# Altium project TK530_Kraftbakplan.PrjPcb
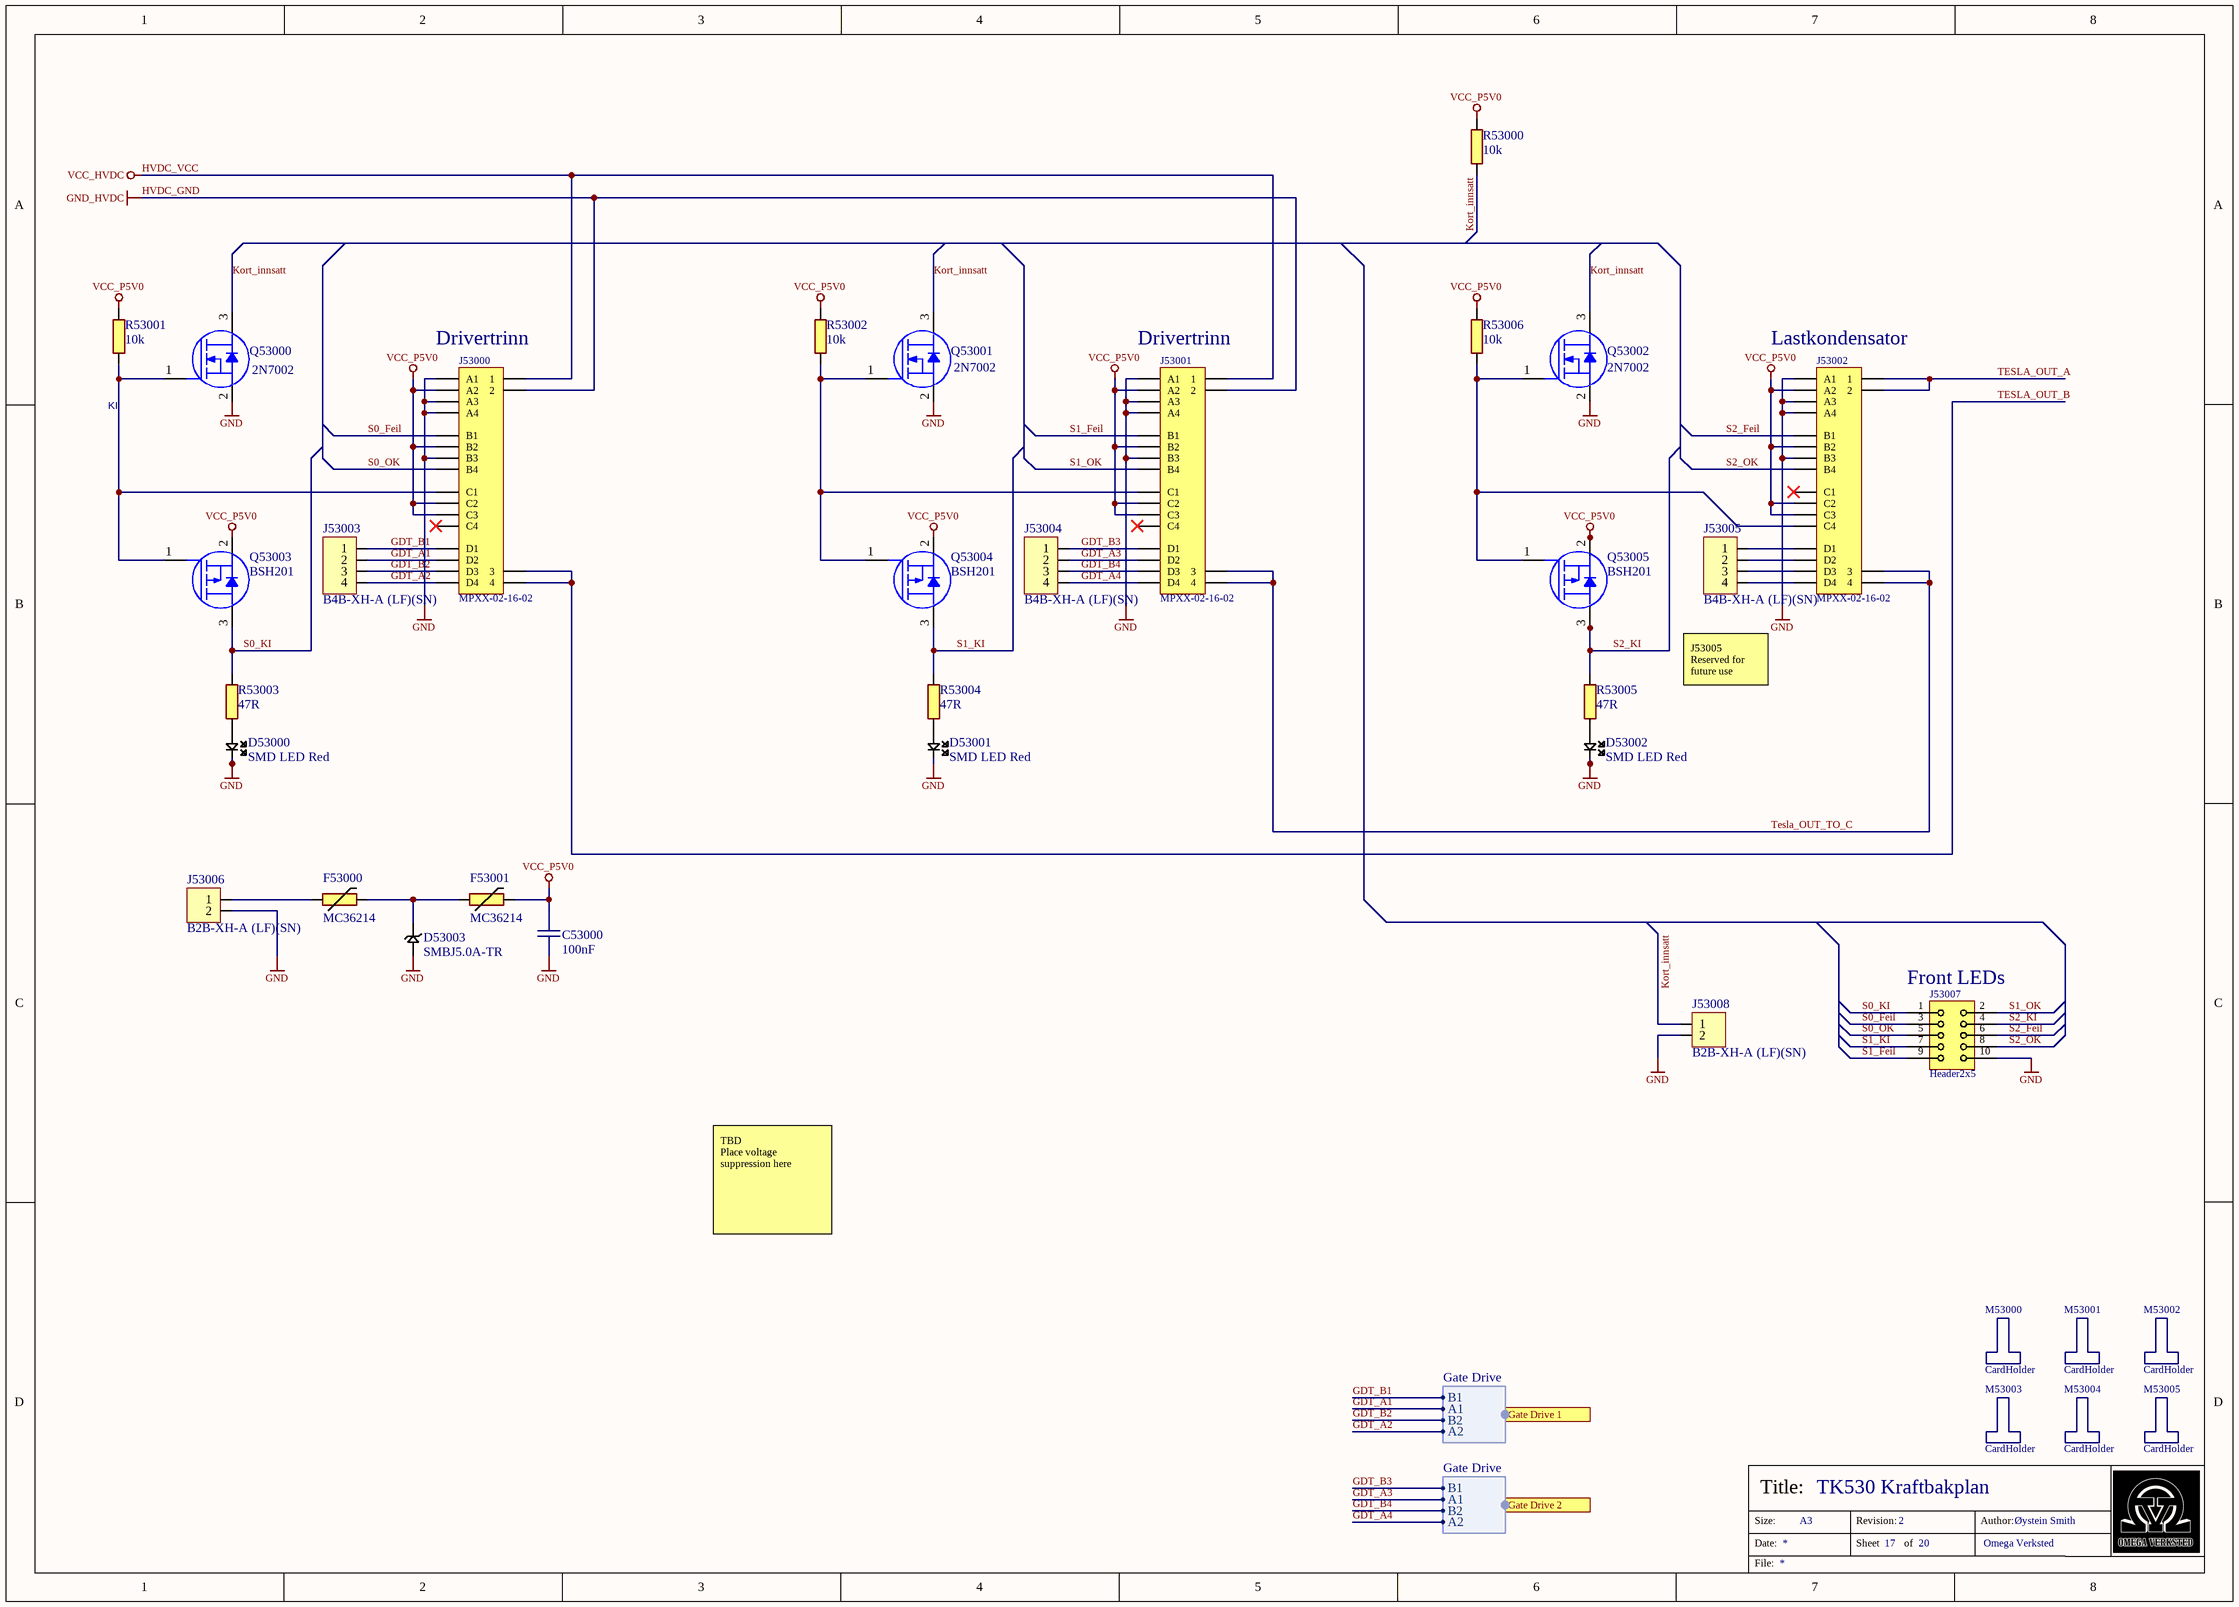
[diagram p0: TK530_Kraftbakplan.SchDoc]
1 sheet, 35 parts. Net scope: flat (ports and power ports of the same name join across sheets).
Board file: TK530_Kraftbakplan.PcbDoc

## Sheet TK530_Kraftbakplan.SchDoc: TK530 Kraftbakplan
size A3; Author: Øystein Smith; Organization: Omega Verksted; DocumentNumber: 17; Revision: 2; SheetNumber: 17; SheetTotal: 20

### Parts
C53000  100nF  [CAPC0603(1608)55_N]
D53000  SMD LED Red  [I_LEDC0603(1608)_N]
D53001  SMD LED Red  [I_LEDC0603(1608)_N]
D53002  SMD LED Red  [I_LEDC0603(1608)_N]
D53003  SMBJ5.0A-TR  [SODFL535X245-2N]
F53000  MC36214  [RESC0805(2012)_N]
F53001  MC36214  [RESC0805(2012)_N]
J53000  MPXX-02-16-02  [MPSC-02-16-02-7.70-03-L-V-LC]
J53001  MPXX-02-16-02  [MPSC-02-16-02-7.70-03-L-V-LC]
J53002  MPXX-02-16-02  [MPSC-02-16-02-7.70-03-L-V-LC]
J53003  B4B-XH-A (LF)(SN)  [JST_4P]
J53004  B4B-XH-A (LF)(SN)  [JST_4P]
J53005  B4B-XH-A (LF)(SN)  [JST_4P]
J53006  B2B-XH-A (LF)(SN)  [JST_2P]
J53007  Header2x5  [HDRV10W64P254_2X5_2030X900X900B]
J53008  B2B-XH-A (LF)(SN)  [JST_2P]
M53000  CardHolder  [CardHolder900X1900X5000]
M53001  CardHolder  [CardHolder900X1900X5000]
M53002  CardHolder  [CardHolder900X1900X5000]
M53003  CardHolder  [CardHolder900X1900X5000]
M53004  CardHolder  [CardHolder900X1900X5000]
M53005  CardHolder  [CardHolder900X1900X5000]
Q53000  2N7002  [SOT323_N]
Q53001  2N7002  [SOT323_N]
Q53002  2N7002  [SOT323_N]
Q53003  BSH201  [SOT23-3_N]
Q53004  BSH201  [SOT23-3_N]
Q53005  BSH201  [SOT23-3_N]
R53000  10k  [RESC0603(1608)_N]
R53001  10k  [RESC0603(1608)_N]
R53002  10k  [RESC0603(1608)_N]
R53003  47R  [RESC0603(1608)_N]
R53004  47R  [RESC0603(1608)_N]
R53005  47R  [RESC0603(1608)_N]
R53006  10k  [RESC0603(1608)_N]

### Ports
Gate Drive 1 (harness Gate Drive), Gate Drive 2 (harness Gate Drive)

### Harnesses
Gate Drive: B1, A1, B2, A2

### Nets
GND: C53000.1 D53000.2 D53001.2 D53002.2 D53003.1(A) J53000.5(A1) J53000.7(A3) J53000.8(A4) J53000.11(B3) J53001.5(A1) J53001.7(A3) J53001.8(A4) J53001.11(B3) J53002.5(A1) J53002.7(A3) J53002.8(A4) J53002.11(B3) J53006.2 J53007.10 J53008.2 Q53000.2(Source) Q53001.2(Source) Q53002.2(Source)
HVDC_GND: J53000.2 J53001.2  [also labelled GND_HVDC]
HVDC_VCC: J53000.1 J53001.1  [also labelled VCC_HVDC]
VCC_P5V0: C53000.2 F53001.2 J53000.6(A2) J53000.10(B2) J53000.14(C2) J53000.15(C3) J53001.6(A2) J53001.10(B2) J53001.14(C2) J53001.15(C3) J53002.6(A2) J53002.10(B2) J53002.14(C2) J53002.15(C3) Q53003.2(Source) Q53004.2(Source) Q53005.2(Source) R53000.2 R53001.2 R53002.2 R53006.2
GDT_A1: J53000.18(D2) J53003.2 ; port Gate Drive 1.A1
GDT_A2: J53000.20(D4) J53003.4 ; port Gate Drive 1.A2
GDT_A3: J53001.18(D2) J53004.2 ; port Gate Drive 2.A1
GDT_A4: J53001.20(D4) J53004.4 ; port Gate Drive 2.A2
GDT_B1: J53000.17(D1) J53003.1 ; port Gate Drive 1.B1
GDT_B2: J53000.19(D3) J53003.3 ; port Gate Drive 1.B2
GDT_B3: J53001.17(D1) J53004.1 ; port Gate Drive 2.B1
GDT_B4: J53001.19(D3) J53004.3 ; port Gate Drive 2.B2
Kort_innsatt: J53008.1 Q53000.3(Drain) Q53001.3(Drain) Q53002.3(Drain) R53000.1
S0_Feil: J53000.9(B1) J53007.3
S0_KI: J53007.1 Q53003.3(Drain) R53003.2
S0_OK: J53000.12(B4) J53007.5
S1_Feil: J53001.9(B1) J53007.9
S1_KI: J53007.7 Q53004.3(Drain) R53004.2
S1_OK: J53001.12(B4) J53007.2
S2_Feil: J53002.9(B1) J53007.6
S2_KI: J53007.4 Q53005.3(Drain) R53005.2
S2_OK: J53002.12(B4) J53007.8
TESLA_OUT_A: J53002.1 J53002.2
TESLA_OUT_B: J53000.3 J53000.4
Tesla_OUT_TO_C: J53001.3 J53001.4 J53002.3 J53002.4
NetD53000_1: D53000.1 R53003.1
NetD53001_1: D53001.1 R53004.1
NetD53002_1: D53002.1 R53005.1
NetD53003_2: D53003.2(K) F53000.2 F53001.1
NetF53000_1: F53000.1 J53006.1
NetJ53000_13: J53000.13(C1) Q53000.1(Gate) Q53003.1(Gate) R53001.1
NetJ53001_13: J53001.13(C1) Q53001.1(Gate) Q53004.1(Gate) R53002.1
NetJ53002_16: J53002.16(C4) Q53002.1(Gate) Q53005.1(Gate) R53006.1
NetJ53002_17: J53002.17(D1) J53005.1
NetJ53002_18: J53002.18(D2) J53005.2
NetJ53002_19: J53002.19(D3) J53005.3
NetJ53002_20: J53002.20(D4) J53005.4

Not connected (* = marked no-connect by the designer): J53000 16(C4)*; J53001 16(C4)*; J53002 13(C1)*

### Notes on the sheet
- KI
- (near J53000) Drivertrinn
- (near J53001) Drivertrinn
- (near J53002) Lastkondensator
- J53005 Reserved for future use
- (near J53007) Front LEDs
- TBD
  Place voltage suppression here
- Size:
- Date:
- Title:
- A3
- Revision:
- Sheet
- of
- Author:
- File:

### Library data of the parts
C53000 = 5152: X7R 50V 5%; pakke_opprettet_av: 815; pris: 1; nokkelord: Kondensator, Capacitor, CAP; pakketype: 0603; id: 5152; leverandor_varenr: 1759122; produsent: Multicomp; leverandor: Farnell; rad: 21; rom: OV; lager_type: Baklager; dybde: 0; antall: 1000; komponenttype: 2; navn: 100nF; pakke_opprettet: 18/02/2015 14:18:13; symbol_opprettet_av: 815; symbol_opprettet: 14/11/2014 20:19:34; hylle: 0
D53000-D53002 = 5143: SMD; pakke_opprettet_av: 815; pris: 1; pakketype: 0603; id: 5143; rad: 0; rom: OV; lager_type: Fremlager; dybde: 2; hylle: 6; antall: 50; leverandor_varenr: 8554641; produsent: Avago; leverandor: Farnell; komponenttype: 9; navn: SMD LED Red; pakke_opprettet: 06/07/2014 18:55:44; symbol_opprettet_av: 815; symbol_opprettet: 06/07/2014 18:59:47; nokkelord: SMD
D53003 = 5314: Transient Voltage Suppressor, TVS, Transil SMBJ Series, Unidirectional, 5 V, SMD, 2, 6.4 V; id: 5314; pakke_opprettet_av: 815; leverandor_varenr: 9886311; pris: 1; produsent: ST Microelectronics; leverandor: Farnell; komponenttype: 9; pakke_opprettet: 14/03/2016 19:17:15; symbol_opprettet_av: 815; symbol_opprettet: 28/06/2014 15:19:53; navn: SMBJ5.0A-TR; pakketype: SMD
F53000 F53001 = 5311: FUSE, PTC RESET, SMD, 16V, 500MA; id: 5311; pakke_opprettet_av: 815; leverandor_varenr: 1861181; pris: 2; produsent: Multicomp; leverandor: Farnell; pakketype: 0805; pakke_opprettet: 27/01/2016 14:23:16; symbol_opprettet_av: 815; symbol_opprettet: 11/03/2016 15:38:25; navn: MC36214
J53000-J53002 = 3220: SAMTEC Connector; pakke_opprettet_av: 815; pris: 30; pakketype: TH; id: 3220; komponenttype: 11; leverandor: Mouser; nokkelord: Kan kjøpes rett fra SAMTEC; navn: MPSC-02-16-02-7.70-03-L-V-LC; pakke_opprettet: 13/07/2014 16:35:38; symbol_opprettet_av: 815; symbol_opprettet: 13/07/2014 16:35:21; produsent: SAMTEC; leverandor_varenr: MPSC-02-16-02-7.70-03-L-V-LC
J53003-J53005 = 3046: JST 4pin (pris pr. stk.); pakke_opprettet_av: 815; pris: 2; nokkelord: Connector, Kontakt; pakketype: TH; id: 3046; rad: 3; rom: OV; lager_type: Fremlager; dybde: 0; hylle: 6; antall: 94; leverandor_varenr: 1516278; leverandor: Farnell; komponenttype: 11; navn: B4B-XH-A (LF)(SN); pakke_opprettet: 28/06/2014 18:25:23; symbol_opprettet_av: 815; symbol_opprettet: 28/06/2014 15:33:28; produsent: JST
J53006 = 4043: JST 2pin (pris pr. stk.); pakke_opprettet_av: 815; pris: 2; nokkelord: Connector, Kontakt; pakketype: TH; id: 4043; rad: 3; rom: OV; lager_type: Fremlager; dybde: 0; hylle: 6; antall: 120; leverandor_varenr: 1516276; leverandor: Farnell; komponenttype: 11; navn: B2B-XH-A (LF)(SN); pakke_opprettet: 28/06/2014 18:25:03; symbol_opprettet_av: 815; symbol_opprettet: 28/06/2014 15:33:17; produsent: JST
J53007 = 3224: Header; navn: Header 2X5 Shrouded; pakke_opprettet_av: 815; pris: 5; pakketype: TH; id: 3224; leverandor_varenr: 2215304; produsent: Amphenol; leverandor: Farnell; komponenttype: 11; pakke_opprettet: 12/07/2014 17:42:52; symbol_opprettet_av: 815; symbol_opprettet: 13/11/2014 11:03:55; nokkelord: Header
J53008 = 4043: JST 2pin (pris pr. stk.); id: 4043; pakke_opprettet_av: 815; pris: 2; nokkelord: Connector, Kontakt; pakketype: TH; rad: 3; rom: OV; lager_type: Fremlager; dybde: 0; hylle: 6; antall: 120; leverandor_varenr: 1516276; leverandor: Farnell; komponenttype: 11; pakke_opprettet: 28/06/2014 18:25:03; symbol_opprettet_av: 815; symbol_opprettet: 28/06/2014 15:33:17; navn: B2B-XH-A (LF)(SN); produsent: JST
M53000-M53005 = 4028: Støtter kort i bakplan; navn: KortStøtte 50mm; pakke_opprettet_av: 815; pris: 5; nokkelord: support, cardholder, kortholder; pakketype: TH; id: 4028; pakke_opprettet: 25/03/2017 04:47:31; symbol_opprettet_av: 815; symbol_opprettet: 12/07/2014 20:29:53
Q53000-Q53002 = 3075: N-Channel MOSFET 300mA; id: 3075; rad: 2; rom: OV; lager_type: Fremlager; dybde: 0; hylle: 3; antall: 810; pakke_opprettet_av: 1165; symbol_opprettet_av: 774; leverandor_varenr: 1829184; pris: 1; leverandor: Farnell; pakketype: SOT-323; komponenttype: 4; pakke_opprettet: 12/05/2018 20:42:12; symbol_opprettet: 11/07/2014 23:17:04; navn: 2N7002
Q53003-Q53005 = 3085: P-Channel MOSFET 300mA; id: 3085; pakke_opprettet_av: 815; symbol_opprettet_av: 1150; leverandor_varenr: 1758073; pris: 3; produsent: NXP Semiconductors; leverandor: Farnell; pakketype: SOT; rom: OV; lager_type: Fremlager; dybde: 0; antall: 51; komponenttype: 4; Status: New; pakke_opprettet: 08/07/2014 20:37:25; symbol_opprettet: 14/09/2016 17:47:57; navn: BSH201; rad: 3; hylle: 3
R53000-R53002 R53006 = 5264: 0.1W 1% Thick film resistor; id: 5264; rad: 0; rom: OV; lager_type: Fremlager; dybde: 72; hylle: 2; antall: 4; pakke_opprettet_av: 815; leverandor_varenr: 2447230; nokkelord: Resistor Motstand; produsent: Multicomp; leverandor: Farnell; pakketype: 0603; komponenttype: 1; pakke_opprettet: 08/07/2014 21:15:30; symbol_opprettet_av: 815; symbol_opprettet: 08/07/2014 21:16:33; navn: 10k; pris: 0
R53003-R53005 = 4889: 0.1W 1% Thick film resistor; rad: 0; rom: OV; lager_type: Fremlager; dybde: 16; hylle: 2; antall: 195; pakke_opprettet_av: 815; pakketype: 0603; id: 4889; komponenttype: 1; leverandor: Farnell; leverandor_varenr: 2447378; produsent: Multicomp; navn: 47R; pakke_opprettet: 08/07/2014 21:15:30; symbol_opprettet_av: 815; symbol_opprettet: 08/07/2014 21:16:33; pris: 0; nokkelord: Resistor